# EAGLE design Senaino (EAGLE 8.1.0)
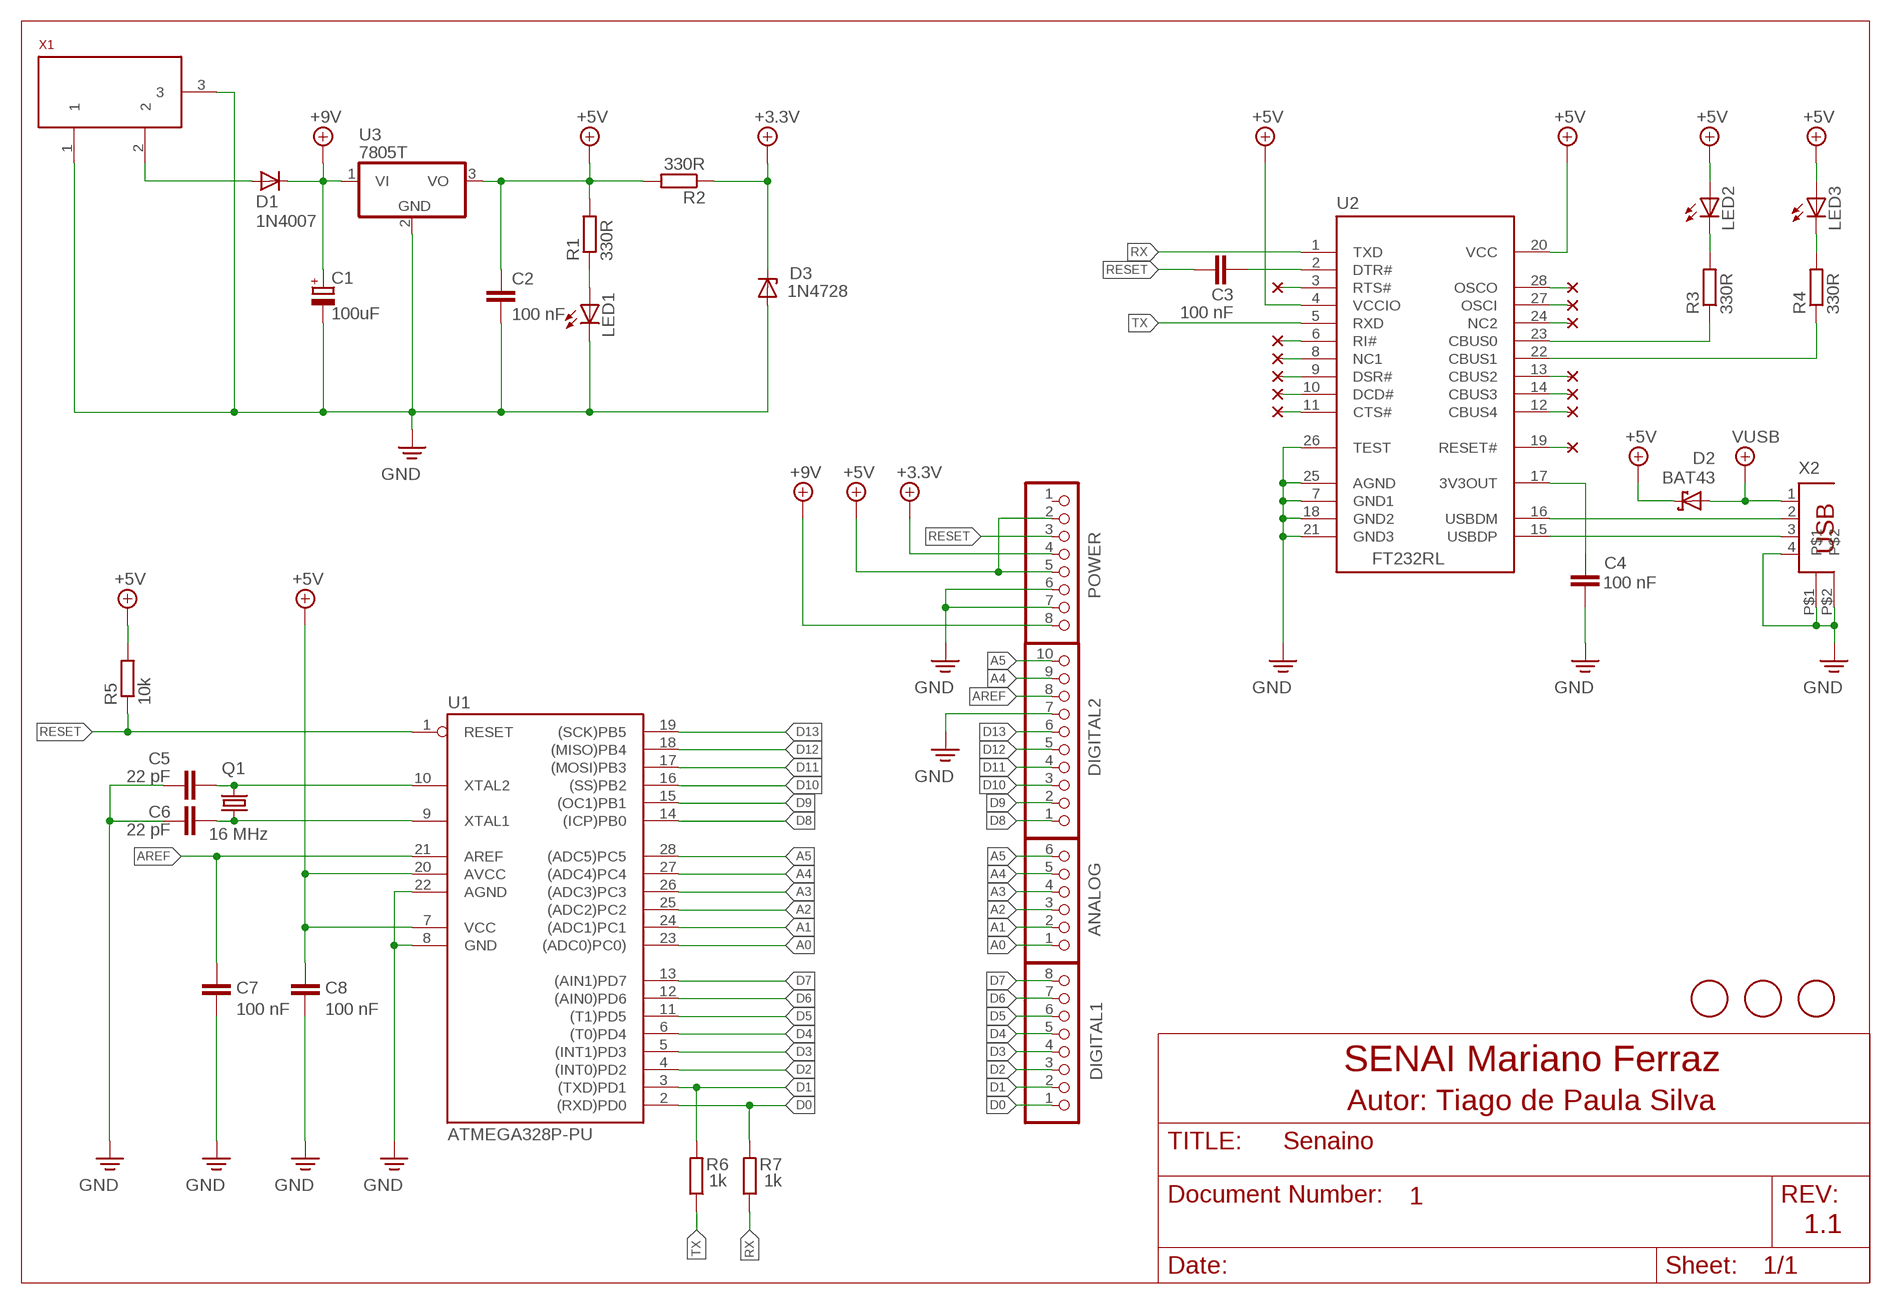
[diagram p0: schematic, sheet 1]

## Parts
ANALOG  PINHD-1X6  [1X06]
C1  100uF  CPOL-EUE2-5  [E2-5]
C2  100 nF  C-EU025-024X044  [C025-024X044]
C3  100 nF  C-EU025-024X044  [C025-024X044]
C4  100 nF  C-EU025-024X044  [C025-024X044]
C5  22 pF  C-EU025-024X044  [C025-024X044]
C6  22 pF  C-EU025-024X044  [C025-024X044]
C7  100 nF  C-EU025-024X044  [C025-024X044]
C8  100 nF  C-EU025-024X044  [C025-024X044]
D1  1N4007  1N4148DO35-7  [DO35-7]
D2  BAT43  SCHOTTKY-DIODEDO35-7  [DIODE_DO35-7]
D3  1N4728  [DO41Z10]
DIGITAL1  PINHD-1X8  [1X08]
DIGITAL2  PINHD-1X10_ARD  [1X10]
FD1  FIDUCIALMOUNT  [FIDUCIA-MOUNT]
FD2  FIDUCIALMOUNT  [FIDUCIA-MOUNT]
FD3  FIDUCIALMOUNT  [FIDUCIA-MOUNT]
LED1  LED3MM  [LED3MM]
LED2  LED3MM  [LED3MM]
LED3  LED3MM  [LED3MM]
POWER  PINHD-1X8  [1X08]
Q1  16 MHz  CRYSTALHC49S  [HC49/S]
R1  330R  R-EU_0204/7  [0204/7]
R2  330R  R-EU_0204/7  [0204/7]
R3  330R  R-EU_0204/7  [0204/7]
R4  330R  R-EU_0204/7  [0204/7]
R5  10k  R-EU_0204/7  [0204/7]
R6  1k  R-EU_0204/7  [0204/7]
R7  1k  R-EU_0204/7  [0204/7]
U1  ATMEGA328P-PU  [DIL28-3]
U2  FT232RL  [SSOP28]
U3  7805T  [TO220H]
X1  POWERSUPPLY_DC21MMX  [POWERSUPPLY_DC-21MM]
X2  PN61729  [PN61729]

## Nets
+3.3V: D3.C POWER.4 R2.1
+5V: C2.1 C8.1 D2.C(A) LED2.A LED3.A POWER.2 POWER.5 R1.2 R2.2 R5.2 U1.7(VCC) U1.20(AVCC) U2.4(VCCIO) U2.20(VCC) U3.3(VO)
+9V: C1.+ D1.C POWER.8 U3.1(VI)
A0: ANALOG.1 U1.23((ADC0)PC0))
A1: ANALOG.2 U1.24((ADC1)PC1)
A2: ANALOG.3 U1.25((ADC2)PC2)
A3: ANALOG.4 U1.26((ADC3)PC3)
A4: ANALOG.5 DIGITAL2.9 U1.27((ADC4)PC4)
A5: ANALOG.6 DIGITAL2.10 U1.28((ADC5)PC5)
AREF: C7.1 DIGITAL2.8 U1.21(AREF)
D0: DIGITAL1.1 R7.2 U1.2((RXD)PD0)
D1: DIGITAL1.2 R6.2 U1.3((TXD)PD1)
D2: DIGITAL1.3 U1.4((INT0)PD2)
D3: DIGITAL1.4 U1.5((INT1)PD3)
D4: DIGITAL1.5 U1.6((T0)PD4)
D5: DIGITAL1.6 U1.11((T1)PD5)
D6: DIGITAL1.7 U1.12((AIN0)PD6)
D7: DIGITAL1.8 U1.13((AIN1)PD7)
D8: DIGITAL2.1 U1.14((ICP)PB0)
D9: DIGITAL2.2 U1.15((OC1)PB1)
D10: DIGITAL2.3 U1.16((SS)PB2)
D11: DIGITAL2.4 U1.17((MOSI)PB3)
D12: DIGITAL2.5 U1.18((MISO)PB4)
D13: DIGITAL2.6 U1.19((SCK)PB5)
GND [gnd]: C1.- C2.2 C4.1 C5.1 C6.1 C7.2 C8.2 D3.A DIGITAL2.7 LED1.K(C) POWER.6 POWER.7 U1.8(GND) U1.22(AGND) U2.7(GND1) U2.18(GND2) U2.21(GND3) U2.25(AGND) U2.26(TEST) U3.2(GND) X1.1 X1.3 X2.4 X2.P$1 X2.P$2
N$1: D1.A X1.2
N$2: U2.16(USBDM) X2.2
N$3: C3.2 U2.2(DTR#)
N$4: R3.1 U2.23(CBUS0)
N$5: U2.15(USBDP) X2.3
N$8: LED2.K(C) R3.2
N$9: LED3.K(C) R4.2
N$10: R4.1 U2.22(CBUS1)
N$11: C4.2 U2.17(3V3OUT)
N$12: U2.11(CTS#)
N$13: U2.6(RI#)
N$14: U2.8(NC1)
N$15: U2.9(DSR#)
N$16: U2.10(DCD#)
N$17: U2.28(OSCO)
N$18: U2.27(OSCI)
N$19: U2.24(NC2)
N$20: U2.13(CBUS2)
N$21: U2.14(CBUS3)
N$22: U2.12(CBUS4)
N$23: U2.19(RESET#)
N$27: U2.3(RTS#)
N$29: C5.2 Q1.2 U1.10(XTAL2)
N$30: C6.2 Q1.1 U1.9(XTAL1)
N$31: LED1.A R1.1
RESET: C3.1 POWER.3 R5.1 U1.1(RESET)
RX: R7.1 U2.1(TXD)
TX: R6.1 U2.5(RXD)
VUSB: D2.A(C) X2.1
Unconnected: POWER.1

## Notes on the sheet
- SENAI Mariano Ferraz
- Autor: Tiago de Paula Silva
- 1
- 1.1

## Library data of the parts
ANALOG = SmartPrj:PINHD-1X6: PIN HEADER
C1 = rcl:CPOL-EU: POLARIZED CAPACITOR, European symbol
C2-C8 = rcl:C-EU: CAPACITOR, European symbol
D1 = diode:1N4148: DIODE high speed (Philips)
D2 = eagle-ltspice:SCHOTTKY-DIODE: Schottky Diode; SPICEMODEL: NONE; SPICEPREFIX: D; SPICETYPE: diode
D3 = diode:1N4728: Z DIODE 3.3 V, 1W, 5 percent
DIGITAL1 POWER = SmartPrj:PINHD-1X8: PIN HEADER
DIGITAL2 = SmartPrj:PINHD-1X10_ARD: PIN HEADER
FD1-FD3 = SmartPrj:FIDUCIALMOUNT
LED1-LED3 = led:LED: LED OSRAM: - CHIPLED LG R971, LG N971, LY N971, LG Q971, LY Q971, LO R971, LY R971 LH N974, LH R974 LS Q976, LO Q976, LY Q976 LO Q996 - Hyper CHIPLED LW Q18S LB Q993, LB Q99A, LB R99A - SideLED LS A670, LO A670, LY A670, LG A670, LP A670 LB A673, LV A673, LT A673, LW A673 LH A674 LY A675 LS A676, LA A676, LO A676, LY A676, LW A676 LS A679, LY A679, LG A679 - Hyper Micro SIDELED® LS Y876, LA Y876, LO Y876, LY Y876 LT Y87S - SmartLED LW L88C, LW L88S LB L89C, LB L89S, LG L890 LS L89K, LO L89K, LY L89K LS L896, LA L896, LO L896, LY L896 - TOPLED LS T670, LO T670, LY T670, LG T670, LP T670 LSG T670, LSP T670, LSY T670, LOP T670, LYG T670 LG T671, LOG T671, LSG T671 LB T673, LV T673, LT T673, LW T673 LH T674 LS T676, LA T676, LO T676, LY T676, LB T676, LH T676, LSB T676, LW T676 LB T67C, LV T67C, LT T67C, LS T67K, LO T67K, LY T67K, LW E67C LS E67B, LA E67B, LO E67B, LY E67B, LB E67C, LV E67C, LT E67C LW T67C LS T679, LY T679, LG T679 LS T770, LO T770, LY T770, LG T770, LP T770 LB T773, LV T773, LT T773, LW T773 LH T774 LS E675, LA E675, LY E675, LS T675 LS T776, LA T776, LO T776, LY T776, LB T776 LHGB T686 LT T68C, LB T68C - Hyper Mini TOPLED® LB M676 - Mini TOPLED Santana® LG M470 LS M47K, LO M47K, LY M47K Source: http://www.osram.convergy.de LUXEON: - LUMILED® LXK2-PW12-R00, LXK2-PW12-S00, LXK2-PW14-U00, LXK2-PW14-V00 LXK2-PM12-R00, LXK2-PM12-S00, LXK2-PM14-U00 LXK2-PE12-Q00, LXK2-PE12-R00, LXK2-PE12-S00, LXK2-PE14-T00, LXK2-PE14-U00 LXK2-PB12-K00, LXK2-PB12-L00, LXK2-PB12-M00, LXK2-PB14-N00, LXK2-PB14-P00, LXK2-PB14-Q00 LXK2-PR12-L00, LXK2-PR12-M00, LXK2-PR14-Q00, LXK2-PR14-R00 LXK2-PD12-Q00, LXK2-PD12-R00, LXK2-PD12-S00 LXK2-PH12-R00, LXK2-PH12-S00 LXK2-PL12-P00, LXK2-PL12-Q00, LXK2-PL12-R00 Source: www.luxeon.com KINGBRIGHT: KA-3528ASYC Source: www.kingbright.com
Q1 = crystal:CRYSTAL: CRYSTAL; OC_FARNELL: 1667008; OC_NEWARK: unknown
R1-R7 = rcl:R-EU_: RESISTOR, European symbol
U1 = SmartPrj:ATMEGA328P-: MICROCONTROLLER 4 Kbytes FLASH 128 bytes SRAM 256 bytes EEPROM UART 6-channel 10 bit ADC
U2 = MySMD2:FT232RL
U3 = linear:78*: Positive VOLTAGE REGULATOR Source: http://cache.national.com/ds/LM/LM78L05.pdf http://www.fairchildsemi.com/ds/LM/LM7805.pdf
X1 = SmartPrj:POWERSUPPLY_DC21MM
X2 = SmartPrj:PN61729: BERG USB connector

## Net classes
0 default: width 0.254 mm, clearance 0.254 mm
1 power: width 0.61 mm, drill 0.61 mm, clearance 0.254 mm
2 gnd: width 0.305 mm, drill 0.559 mm, clearance 0.254 mm
3 usbvcc: width 0.508 mm, drill 0.61 mm, clearance 0.254 mm
4 aref: width 0.406 mm, drill 0.61 mm, clearance 0.254 mm

## Board
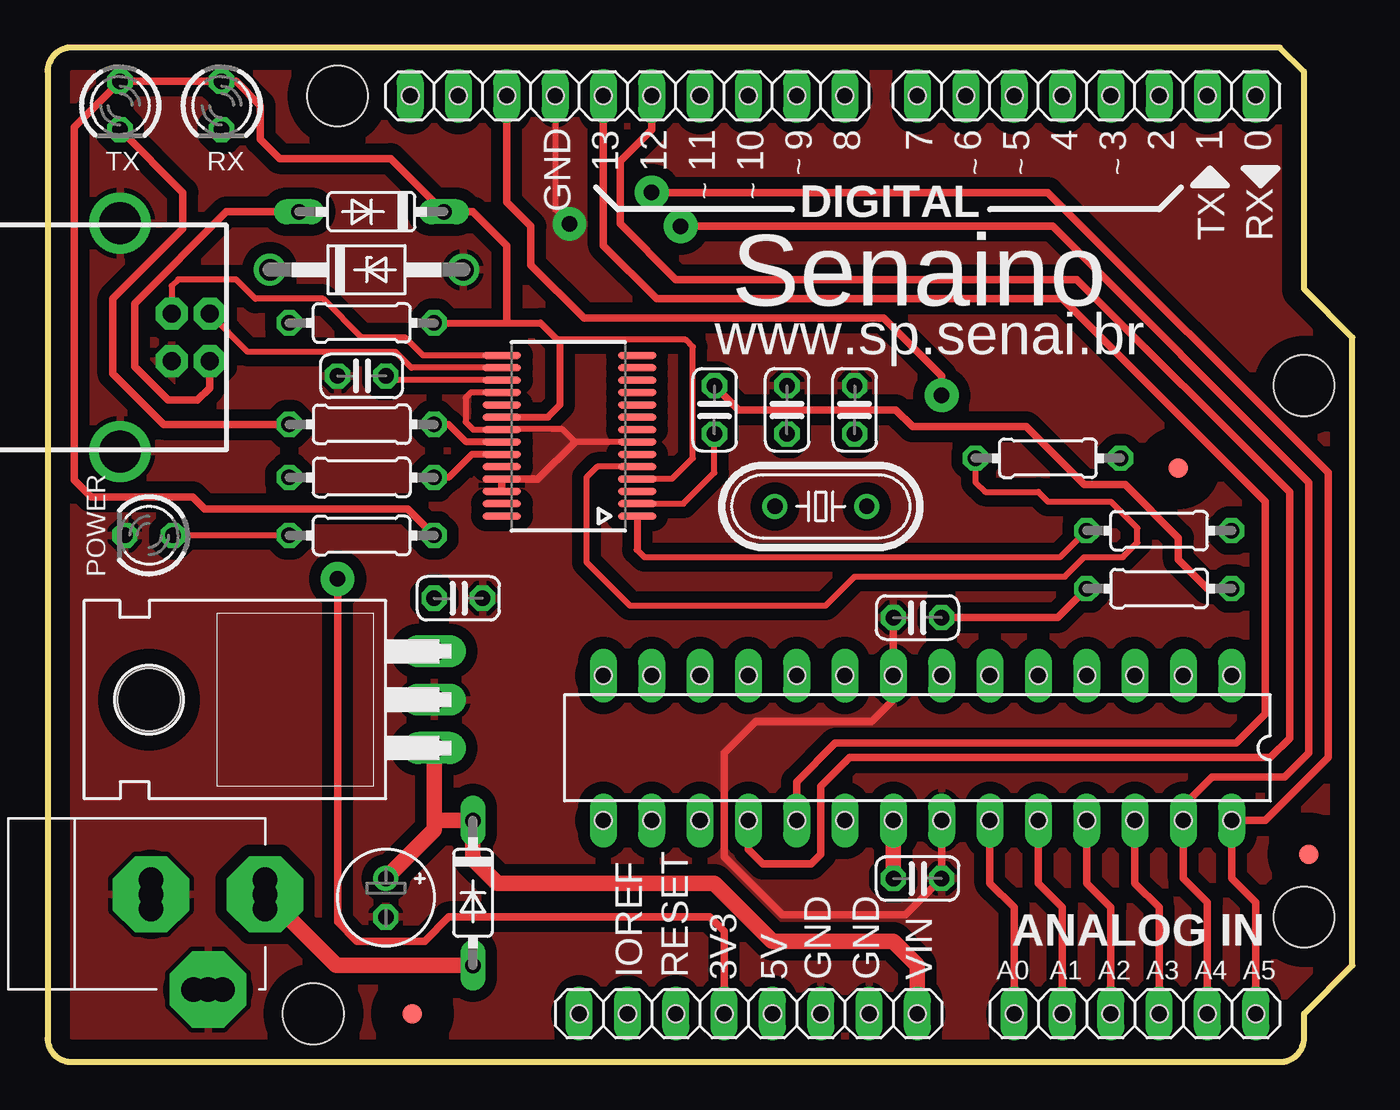
[diagram p1: board, top side]
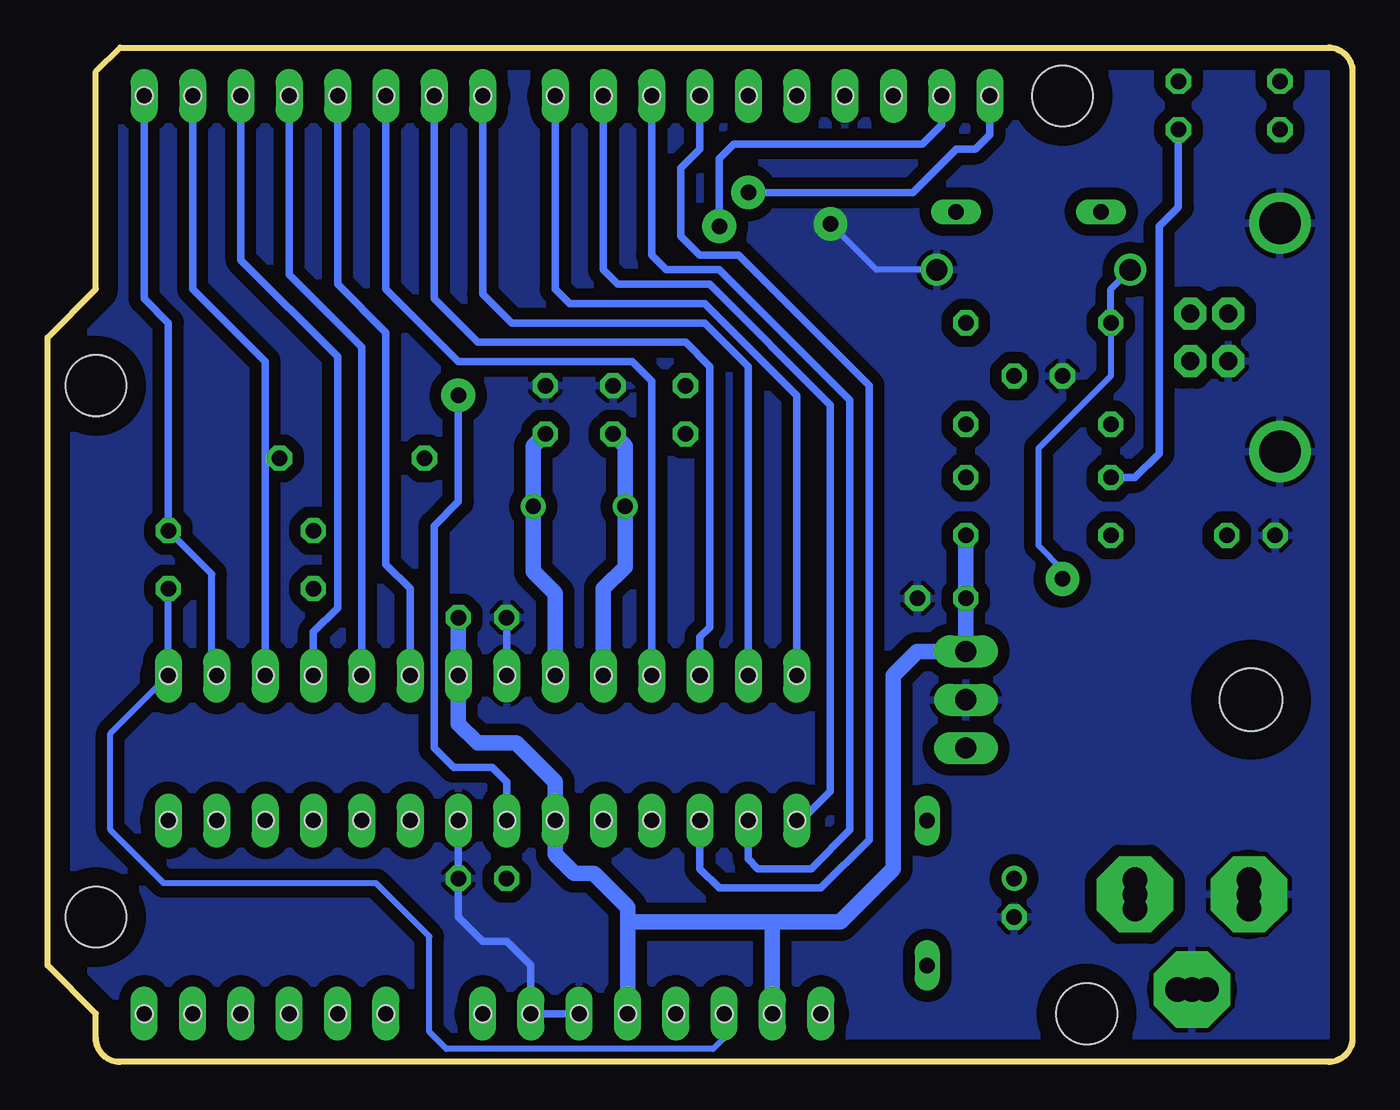
[diagram p2: board, bottom side, seen from below]

Size 68.58 x 53.34 mm. Coordinates in mm from the lower left corner, seen from the top.
Outline: 0,52.07 0,1.27 arc90 1.27,0 64.77,0 arc90 66.04,1.27 66.04,2.54 68.58,5.08 68.58,38.1 66.04,40.64 66.04,52.07 64.77,53.34 1.27,53.34 arc90 0,52.07
Copper layers (1*16): Top 0.035mm / dielectric 1.5mm / Bottom 0.035mm
Design rules "default *": minimum track width 16mil, minimum drill 24mil, track to track 8mil, track to pad 8mil, pad to pad 8mil, via to via 8mil, smd to smd 8mil, copper to edge 40mil, drill to drill 8mil, minimum pad ring 10mil, minimum via ring 8mil, stop-mask expansion 4mil, vias tented up to drill 0mil, thermal gap 10mil
Holes 3.2 mm at 13.97,2.54 66.04,7.62 66.04,35.56 15.24,50.8
Holes 0.9 mm at 19.05,50.8 21.59,50.8 24.13,50.8 26.67,50.8 29.21,50.8 31.75,50.8 34.29,50.8 36.83,50.8 39.37,50.8 41.91,50.8 45.72,50.8 48.26,50.8 50.8,50.8 53.34,50.8 55.88,50.8 58.42,50.8 60.96,50.8 63.5,50.8 62.23,20.32 59.69,20.32 57.15,20.32 54.61,20.32 52.07,20.32 49.53,20.32 46.99,20.32 44.45,20.32 41.91,20.32 39.37,20.32 36.83,20.32 34.29,20.32 31.75,20.32 29.21,20.32 29.21,12.7 31.75,12.7 34.29,12.7 36.83,12.7 39.37,12.7 41.91,12.7 44.45,12.7 46.99,12.7 49.53,12.7 52.07,12.7 54.61,12.7 57.15,12.7 59.69,12.7 62.23,12.7 50.8,2.54 53.34,2.54 55.88,2.54 58.42,2.54 60.96,2.54 63.5,2.54 27.94,2.54 30.48,2.54 33.02,2.54 35.56,2.54 38.1,2.54 40.64,2.54 43.18,2.54 45.72,2.54

### Footprints (pad centres in the part's own frame; a part is rotated, then mirrored left to right if it is on the bottom)
1X06 = drill 0.85 pad 1.422 long: 1 -6.35,0; 2 -3.81,0; 3 -1.27,0; 4 1.27,0; 5 3.81,0; 6 6.35,0
E2-5 = drill 0.813 pad 1.27: + -1.016,0 | drill 0.813 pad 1.27 octagon: - 1.016,0
C025-024X044 = drill 0.813 octagon: 1 -1.27,0; 2 1.27,0
DO35-7 = drill 0.813 long: A 3.81,0; C -3.81,0
DIODE_DO35-7 = drill 0.813 long: A 3.81,0; C -3.81,0
DO41Z10 = drill 1.118: A 5.08,0; C -5.08,0
1X08 = drill 0.85 pad 1.422 long: 1 -8.89,0; 2 -6.35,0; 3 -3.81,0; 4 -1.27,0; 5 1.27,0; 6 3.81,0; 7 6.35,0; 8 8.89,0
1X10 = drill 0.85 pad 1.422 long: 1 -11.43,0; 2 -8.89,0; 3 -6.35,0; 4 -3.81,0; 5 -1.27,0; 6 1.27,0; 7 3.81,0; 8 6.35,0; 9 8.89,0; 10 11.43,0
FIDUCIA-MOUNT = smd 1.016 x 1.016: P$1 0,0
LED3MM = drill 0.813 octagon: A -1.27,0; K 1.27,0
HC49/S = drill 0.813: 1 -2.413,0; 2 2.413,0
0204/7 = drill 0.813 octagon: 1 -3.81,0; 2 3.81,0
DIL28-3 = drill 0.85 pad 1.422 long: 1 -16.51,-3.81; 2 -13.97,-3.81; 3 -11.43,-3.81; 4 -8.89,-3.81; 5 -6.35,-3.81; 6 -3.81,-3.81; 7 -1.27,-3.81; 8 1.27,-3.81; 9 3.81,-3.81; 10 6.35,-3.81; 11 8.89,-3.81; 12 11.43,-3.81; 13 13.97,-3.81; 14 16.51,-3.81; 15 16.51,3.81; 16 13.97,3.81; 17 11.43,3.81; 18 8.89,3.81; 19 6.35,3.81; 20 3.81,3.81; 21 1.27,3.81; 22 -1.27,3.81; 23 -3.81,3.81; 24 -6.35,3.81; 25 -8.89,3.81; 26 -11.43,3.81; 27 -13.97,3.81; 28 -16.51,3.81
SSOP28 = smd 0.381 x 2.032: 1 0,0; 2 0.65,0; 3 1.3,0; 4 1.95,0; 5 2.6,0; 6 3.25,0; 7 3.9,0; 8 4.55,0; 9 5.2,0; 10 5.85,0; 11 6.5,0; 12 7.15,0; 13 7.8,0; 14 8.45,0; 15 8.45,7.112; 16 7.8,7.112; 17 7.15,7.112; 18 6.5,7.112; 19 5.85,7.112; 20 5.2,7.112; 21 4.55,7.112; 22 3.9,7.112; 23 3.25,7.112; 24 2.6,7.112; 25 1.95,7.112; 26 1.3,7.112; 27 0.65,7.112; 28 0,7.112
TO220H = drill 1.118 long: 1 -2.54,-10.16; 2 0,-10.16; 3 2.54,-10.16 | hole 3.302: 0,4.826
POWERSUPPLY_DC-21MM = drill 1.3 pad 4 octagon: 1 -5.08,-3.353; 2 -0.076,-6.35; 3 -0.076,-0.356 | drill 1.3: 4 -5.08,-4.115; 5 -5.08,-2.591; 6 -0.838,-0.356; 7 0.686,-0.356; 8 -0.838,-6.35; 9 0.686,-6.35
PN61729 = drill 0.95 pad 1.676 octagon: 1 1.25,4.71; 2 -1.25,4.71; 3 -1.25,2.71; 4 1.25,2.71 | drill 2.2: P$1 -6,0; P$2 6,0

### Placement (x,y rotation side)
ANALOG  57.15,2.54 0 top
C1  17.78,8.64 270 top
C2  21.59,24.38 0 top
C3  35.05,34.29 270 top
C4  16.51,36.07 0 top
C5  38.86,34.29 270 top
C6  42.42,34.29 270 top
C7  45.72,9.65 0 top
C8  45.72,23.37 180 top
D1  22.35,8.89 270 top
D2  17.02,44.7 180 top
D3  16.76,41.66 0 top
DIGITAL1  54.61,50.8 180 top
DIGITAL2  30.48,50.8 180 top
FD1  59.44,31.24 90 top
FD2  66.29,10.92 90 top
FD3  19.18,2.54 90 top
LED1  5.33,27.69 180 top
LED2  9.14,50.29 270 top
LED3  3.81,50.29 270 top
POWER  36.83,2.54 0 top
Q1  40.64,29.21 180 top
R1  16.51,27.69 0 top
R2  16.51,38.86 0 top
R3  16.51,30.73 180 top
R4  16.51,33.53 180 top
R5  58.42,24.89 180 top
R6  52.58,31.75 0 top
R7  58.42,27.94 0 top
U1  45.72,16.51 180 top
U2  30.99,28.7 90 top
U3  10.16,19.05 90 top
X1  5.08,8.89 90 top
X2  3.81,38.1 270 top

### Tracks (layer width: path | path; a pad name or v marks a point on that pad's centre or on a via)
+3.3V  (via drill 0.81 pad 1.78)
  Top 0.406: POWER.4 35.56,6.86 34.8,7.62 21.08,7.62 19.81,6.35 16.26,6.35 15.24,7.37 v15.24,25.4
  Bottom 0.305: R2.1 12.7,36.07 16.51,32.26 16.51,27.18 15.24,25.91 v15.24,25.4
  Bottom 0.356: R2.1 12.7,40.64 D3.C
+5V
  Top 0.305: 26.23,38.54 26.8,37.97 33.53,37.97 33.91,37.59 33.91,31.75 32.81,30.65 U2.4
  Top 0.356: 26.3,33.9 U2.20 26.28,33.9 26.92,34.54 26.92,37.85 26.23,38.54 25.91,38.86 24.13,38.86 R2.2
  Top 0.406: C8.1 53.09,23.37 R5.2 | 24.13,38.86 24.13,42.93 22.35,44.7 D2.C 18.03,47.5 12.19,47.5 11.18,48.51 11.18,50.29 9.91,51.56 LED2.A LED3.A 1.4,49.15 1.4,30.61 2.29,29.72 7.62,29.72 8.26,29.08 18.92,29.08 R1.2
  Bottom 0.813: C8.1 U1.7 46.99,17.78 45.97,16.76 43.94,16.76 41.91,14.73 U1.20 41.91,10.92 40.89,9.91 39.88,9.91 38.1,8.13 38.1,7.37 | R1.2 C2.1 U3.3 22.86,21.59 24.13,20.32 24.13,10.16 26.92,7.37 30.48,7.37 | POWER.2 30.48,7.37 | POWER.5 38.1,7.37 | 38.1,7.37 30.48,7.37
+9V
  Top 0.813: 45.72,3.81 POWER.8 45.72,5.08 44.45,6.35 38.1,6.35 35.05,9.4 23.62,9.4 22.35,10.67 D1.C 20.32,12.7 | C1.+ 20.32,12.19 20.32,12.7 | 20.32,12.7 U3.1
A0
  Top 0.406: ANALOG.1 50.8,8.13 49.53,9.4 U1.23
A1
  Top 0.406: ANALOG.2 53.34,8.13 52.07,9.4 U1.24
A2
  Top 0.406: ANALOG.3 55.88,8.13 54.61,9.4 U1.25
A3
  Top 0.406: ANALOG.4 58.42,8.13 57.15,9.4 U1.26
A4  (via drill 0.81 pad 1.78)
  Top 0.406: ANALOG.5 60.96,8.38 59.69,9.65 U1.27 59.69,13.46 61.21,14.99 65.02,14.99 66.29,16.26 66.29,30.48 52.83,43.94 v33.27,43.94
  Bottom 0.406: DIGITAL2.9 21.59,49.28 22.61,48.26 32.51,48.26 33.27,47.5 v33.27,43.94
A5  (via drill 0.81 pad 1.78)
  Top 0.406: ANALOG.6 63.5,8.38 62.23,9.65 U1.28 64.01,12.7 67.31,16 67.31,30.99 52.58,45.72 v31.75,45.72
  Bottom 0.406: v31.75,45.72 23.11,45.72 20.83,48.01 19.81,48.01 19.05,48.77 DIGITAL2.10
AREF  (via drill 0.81 pad 1.78)
  Top 0.406: DIGITAL2.8 24.13,45.21 25.4,43.94 25.4,41.91 28.19,39.12 43.94,39.12 46.99,36.07 v46.99,35.05
  Top 0.813: U1.21 C7.1
  Bottom 0.406: U1.21 44.45,14.73 45.21,15.49 47.24,15.49 48.26,16.51 48.26,28.19 46.99,29.46 v46.99,35.05
D0
  Bottom 0.356: U1.2 59.94,20.57 59.94,25.65 R7.2
  Bottom 0.406: R7.2 62.23,38.86 63.5,40.13 DIGITAL1.1
D1
  Bottom 0.406: U1.3 57.15,31.75 | 57.15,31.75 57.15,36.83 60.96,40.64 DIGITAL1.2 | R6.2 57.15,31.75
D2
  Bottom 0.406: U1.4 54.61,22.61 53.34,23.88 53.34,37.08 58.42,42.16 DIGITAL1.3
D3
  Bottom 0.406: U1.5 52.07,37.59 55.88,41.4 DIGITAL1.4
D4
  Bottom 0.406: U1.6 49.53,24.89 50.8,26.16 50.8,38.35 53.34,40.89 DIGITAL1.5
D5
  Bottom 0.406: 36.83,19.81 U1.11 36.83,35.81 37.85,36.83 46.99,36.83 50.8,40.64 DIGITAL1.6
D6
  Bottom 0.406: DIGITAL1.7 48.26,40.13 45.97,37.85 35.05,37.85 33.78,36.58 33.78,22.86 34.29,22.35 U1.12
D7
  Bottom 0.406: DIGITAL1.8 45.72,40.39 44.2,38.86 34.04,38.86 31.75,36.58 U1.13
D8
  Bottom 0.406: DIGITAL2.1 41.91,40.64 41.15,39.88 34.04,39.88 29.21,35.05 U1.14
D9
  Bottom 0.406: DIGITAL2.2 39.37,41.66 38.61,40.89 33.78,40.89 27.43,34.54 27.43,14.22 28.96,12.7 U1.15
D10
  Bottom 0.406: DIGITAL2.3 36.83,42.42 36.07,41.66 33.27,41.66 26.42,34.8 26.42,12.19 28.45,10.16 31.24,10.16 31.75,10.67 U1.16
D11
  Bottom 0.406: U1.17 34.29,10.16 33.27,9.14 27.94,9.14 25.4,11.68 25.4,35.56 32.26,42.42 34.29,42.42 35.31,43.43 35.31,46.99 34.29,48.01 DIGITAL2.4
D12
  Top 0.406: DIGITAL2.5 31.75,49.02 30.1,47.37 30.1,44.07 33.02,41.15 54.1,41.15 65.28,29.97 65.28,17.02 64.26,16 42.16,16 40.64,14.48 40.64,10.92 40.13,10.41 37.59,10.41 36.83,11.18 U1.18
D13
  Top 0.406: DIGITAL2.6 29.21,42.93 32,40.13 53.34,40.13 64.01,29.46 64.01,18.29 63.25,17.53 62.48,16.76 41.4,16.76 39.37,14.73 U1.19
GND  (via drill 0.81 pad 1.78)
  Top 0.305: U2.7 27.72,32.6 27.05,33.27 23.9,33.27 U2.21 22.37,33.25 21.97,33.66 21.97,34.92 22.25,35.2 U2.18 | DIGITAL2.7 26.67,44.83 v27.43,44.07
  Top 0.406: 27.72,32.6 25.77,30.65 U2.25 U2.26 | U1.22 C7.2 45.09,7.75 38.61,7.75 35.56,10.79 35.56,16.26 37.21,17.91 43.31,17.91 44.45,19.05 U1.8 44.45,22.86
  Bottom 0.305: D3.A 25.02,41.66 v27.43,44.07
  Bottom 0.406: U1.8 C8.2 | U1.22 C7.2 46.99,7.62 45.72,6.35 44.45,6.35 43.18,5.08 POWER.7 POWER.6
  pour Bottom (isolate 0.61): 68.58,38.1 68.58,5.08 66.04,2.54 66.04,1.27 arc-90 64.77,0 1.27,0 arc-90 0,1.27 0,52.07 arc-90 1.27,53.34 64.77,53.34 66.04,52.07 66.04,40.64
  pour Top (isolate 0.61): 68.58,38.1 68.58,5.08 66.04,2.54 66.04,1.27 arc-90 64.77,0 1.27,0 arc-90 0,1.27 0,52.07 arc-90 1.27,53.34 64.77,53.34 66.04,52.07 66.04,40.64
N$1
  Top 0.813: X1.2 15.16,5.08 D1.A
N$2
  Top 0.305: U2.16 19.12,36.5 18.29,37.34 10.53,37.34 X2.2
N$3
  Top 0.305: U2.2 33.42,29.35 35.05,30.99 C3.2
N$4
  Top 0.356: U2.23 22.3,31.95 21.08,30.73 R3.1
N$5
  Top 0.305: U2.15 19.74,37.15 18.8,38.1 16.51,38.1 14.48,40.13 10.92,40.13 9.91,41.15 6.86,41.15 6.52,40.81 X2.3
N$8
  Bottom 0.406: R3.2 11.43,30.73 10.16,32 10.16,43.94 9.14,44.96 LED2.K
N$9
  Top 0.406: R4.2 6.1,33.53 3.43,36.2 3.43,40.13 7.11,43.81 7.11,45.72 LED3.K
N$10
  Top 0.356: U2.22 22.01,32.6 21.08,33.53 R4.1
N$11
  Top 0.305: U2.17 18,35.85 C4.2
N$29
  Bottom 0.813: U1.10 39.37,24.89 38.23,26.04 Q1.2 38.23,32.38 C5.2
N$30
  Bottom 0.813: U1.9 41.91,24.64 43.05,25.78 Q1.1 43.05,32.38 C6.2
N$31
  Top 0.305: R1.1 LED1.A
RESET
  Top 0.406: R5.1 60.96,24.89 59.44,26.42 59.44,27.56 56.64,30.35 54.48,30.35 51.44,33.4 45.47,33.4 44.58,34.29 36.32,34.29 C3.1
  Bottom 0.305: POWER.3 33.02,1.27 33.6,0.69 47.62,0.69 48.51,1.57 48.51,6.6 51.31,9.4 62.48,9.4 65.28,12.19 65.28,17.27 U1.1
  Bottom 0.356: U1.1 R5.1
RX
  Top 0.305: 30.99,26.92 31.37,26.54 53.21,26.54 R7.1
  Top 0.356: U2.1 30.99,26.92
TX
  Top 0.305: U2.5 28.89,31.3 28.32,30.73 28.32,26.29 30.61,24 40.89,24 42.42,25.53 53.47,25.53 54.48,26.54 56.52,26.54 57.28,27.3 57.28,28.07 55.88,29.46 52.58,29.46 52.07,29.97 49.28,29.97 48.77,30.48 R6.1
VUSB
  Top 0.406: X2.1 8.52,35.44 7.87,34.8 6.35,34.8 4.57,36.58 4.57,39.88 9.4,44.7 D2.A

### Text on the board
tPlace: 13 | 12 | 11 | 10 | 9 | 8 | 7 | 6 | 5 | 4 | 3 | 2 | 1 | 0 | TX | RX | POWER
tNames: GND | ~ | ~ | ~ | ~ | ~ | ~ | DIGITAL | TX | RX | Senaino | www.sp.senai.br | ANALOG IN | IOREF | RESET | 3V3 | 5V | GND | GND | VIN | A0 | A1 | A2 | A3 | A4 | A5